# Altium schematic sheet AI.SchDoc
size 304 x 304 mm; SheetNumber: 3; SheetTotal: 15
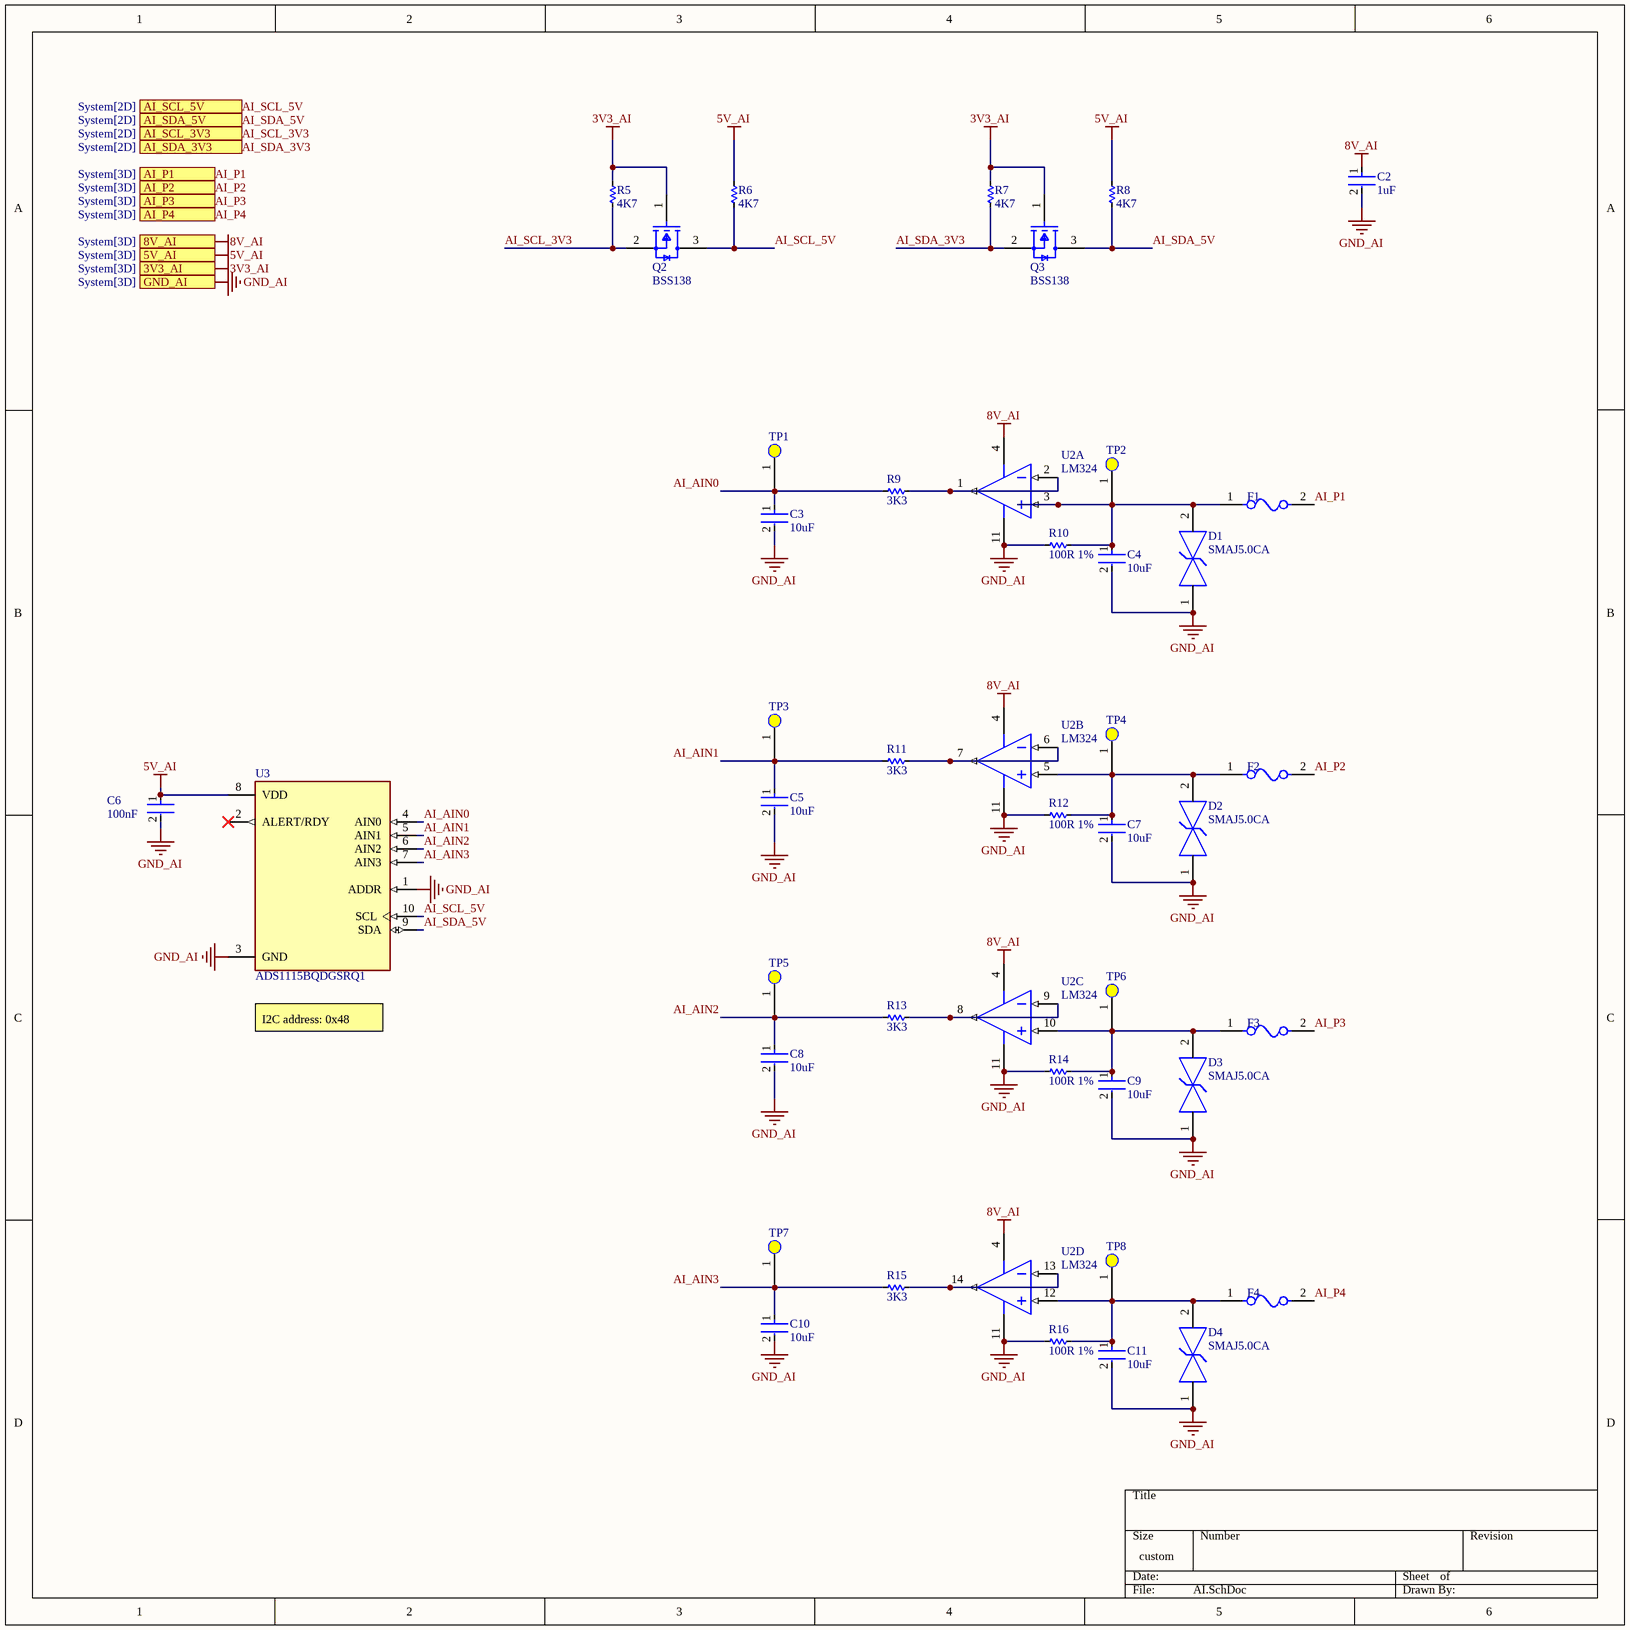
[diagram p0: AI.SchDoc]

## Parts
C2  1uF  [FP-GRM18-0_15-MFG]
C3  10uF  [FP-GRM18-0_15-MFG]
C4  10uF  [FP-GRM18-0_15-MFG]
C5  10uF  [FP-GRM18-0_15-MFG]
C6  100nF  [FP-GRM18-0_15-MFG]
C7  10uF  [FP-GRM18-0_15-MFG]
C8  10uF  [FP-GRM18-0_15-MFG]
C9  10uF  [FP-GRM18-0_15-MFG]
C10  10uF  [FP-GRM18-0_15-MFG]
C11  10uF  [FP-GRM18-0_15-MFG]
D1  SMAJ5.0CA  [FP-SMAJ-MFG]
D2  SMAJ5.0CA  [FP-SMAJ-MFG]
D3  SMAJ5.0CA  [FP-SMAJ-MFG]
D4  SMAJ5.0CA  [FP-SMAJ-MFG]
F1  CLA1683  [FP-0468-MFG]  (value not drawn)
F2  CLA1683  [FP-0468-MFG]  (value not drawn)
F3  CLA1683  [FP-0468-MFG]  (value not drawn)
F4  CLA1683  [FP-0468-MFG]  (value not drawn)
Q2  BSS138  [FP-318-08-IPC_B]
Q3  BSS138  [FP-318-08-IPC_B]
R5  4K7  [RES-SMD-0603]
R6  4K7  [RES-SMD-0603]
R7  4K7  [RES-SMD-0603]
R8  4K7  [RES-SMD-0603]
R9  3K3  [RES-SMD-0603]
R10  100R 1%  [RES-SMD-0805]
R11  3K3  [RES-SMD-0603]
R12  100R 1%  [RES-SMD-0805]
R13  3K3  [RES-SMD-0603]
R14  100R 1%  [RES-SMD-0805]
R15  3K3  [RES-SMD-0603]
R16  100R 1%  [RES-SMD-0805]
TP1  Test Point  [Test Point]  (value not drawn)
TP2  Test Point  [Test Point]  (value not drawn)
TP3  Test Point  [Test Point]  (value not drawn)
TP4  Test Point  [Test Point]  (value not drawn)
TP5  Test Point  [Test Point]  (value not drawn)
TP6  Test Point  [Test Point]  (value not drawn)
TP7  Test Point  [Test Point]  (value not drawn)
TP8  Test Point  [Test Point]  (value not drawn)
U2  LM324  [D0014A_N]  (parts A,B,C,D of 4)
U3  ADS1115BQDGSRQ1  [SOP50P490X110-10N]

## Ports
3V3_AI (see System[3D]), 5V_AI (see System[3D]), 8V_AI (see System[3D]), AI_P1 (see System[3D]), AI_P2 (see System[3D]), AI_P3 (see System[3D]), AI_P4 (see System[3D]), AI_SCL_3V3 (see System[2D]), AI_SCL_5V (see System[2D]), AI_SDA_3V3 (see System[2D]), AI_SDA_5V (see System[2D]), GND_AI (see System[3D])

## Nets
3V3_AI: Q2.1(G) Q3.1(G) R5.1 R7.1 ; port 3V3_AI
5V_AI: C6.1 R6.1 R8.1 U3.8(VDD) ; port 5V_AI
8V_AI: C2.1 U2.4(VCC+) ; port 8V_AI
GND_AI: C2.2 C3.2 C4.2 C5.2 C6.2 C7.2 C8.2 C9.2 C10.2 C11.2 D1.1 D2.1 D3.1 D4.1 R10.2 R12.2 R14.2 R16.2 U2.11(VCC-) U3.1(ADDR) U3.3(GND) ; port GND_AI
AI_AIN0: C3.1 R9.2 TP1.1(Test_Point) U3.4(AIN0)
AI_AIN1: C5.1 R11.2 TP3.1(Test_Point) U3.5(AIN1)
AI_AIN2: C8.1 R13.2 TP5.1(Test_Point) U3.6(AIN2)
AI_AIN3: C10.1 R15.2 TP7.1(Test_Point) U3.7(AIN3)
AI_P1: F1.2 ; port AI_P1
AI_P2: F2.2 ; port AI_P2
AI_P3: F3.2 ; port AI_P3
AI_P4: F4.2 ; port AI_P4
AI_SCL_3V3: Q2.2(S) R5.2 ; port AI_SCL_3V3
AI_SCL_5V: Q2.3(D) R6.2 U3.10(SCL) ; port AI_SCL_5V
AI_SDA_3V3: Q3.2(S) R7.2 ; port AI_SDA_3V3
AI_SDA_5V: Q3.3(D) R8.2 U3.9(SDA) ; port AI_SDA_5V
NetC4_1: C4.1 D1.2 F1.1 R10.1 TP2.1(Test_Point) U2.3(IN1+)
NetC7_1: C7.1 D2.2 F2.1 R12.1 TP4.1(Test_Point) U2.5(IN2+)
NetC9_1: C9.1 D3.2 F3.1 R14.1 TP6.1(Test_Point) U2.10(IN3+)
NetC11_1: C11.1 D4.2 F4.1 R16.1 TP8.1(Test_Point) U2.12(IN4+)
NetR9_1: R9.1 U2.1(OUT1) U2.2(IN1-)
NetR11_1: R11.1 U2.6(IN2-) U2.7(OUT2)
NetR13_1: R13.1 U2.8(OUT3) U2.9(IN3-)
NetR15_1: R15.1 U2.13(IN4-) U2.14(OUT4)

Not connected (* = marked no-connect by the designer): U3 2(ALERT/RDY)*

## Notes on the sheet
- (near U3) I2C address: 0x48

## Library data of the parts
C2 = CMP-2000-05448-2: CAP CER 1UF 10V X5R 0603; Manufacturer Part Number: GRM188R61A106KE69D; Manufacturer: Murata; Temperature Coefficient: 15%; Value: 10uF; Material: Ceramic; Tolerance: 10%; Device Class L1: Passive Components; ComponentLink2Description: Datasheet; Height: 0.95mm; Package: GRM18-0.15; Octopart: https://octopart.com/grm188r61a106ke69d-murata-22851381; Digikey Description: CAP CER 10UF 10V X5R 0603; Temperature Range High: +85°C; Temperature Range Low: -55°C; Temperature Characteristic: X5R; Capacitance: 10uF; RoHS: TRUE; Device Class L2: Capacitors; ComponentLink2URL: https://search.murata.co.jp/Ceramy/image/img/A01X/G101/ENG/GRM188R61A106KE69-01A.pdf; Device Class L3: Ceramic Capacitors; Lead Free: Yes; Mouser Description: Multilayer Ceramic Capacitors MLCC - SMD/SMT 0603 10uF 10volts X5R + - 10%; Category: Cap; Voltage Rating: 10V; Temperature: -55°C to +85°C; Automotive: No
C3-C5 C7-C11 = CMP-2000-05448-2: CAP CER 10UF 10V X5R 0603; Manufacturer Part Number: GRM188R61A106KE69D; Manufacturer: Murata; Temperature Coefficient: 15%; Material: Ceramic; Tolerance: 10%; Device Class L1: Passive Components; ComponentLink2Description: Datasheet; Height: 0.95mm; Package: GRM18-0.15; Octopart: https://octopart.com/grm188r61a106ke69d-murata-22851381; Value: 10uF; Digikey Description: CAP CER 10UF 10V X5R 0603; Temperature Range High: +85°C; Temperature Range Low: -55°C; Temperature Characteristic: X5R; Capacitance: 10uF; RoHS: TRUE; Device Class L2: Capacitors; ComponentLink2URL: https://search.murata.co.jp/Ceramy/image/img/A01X/G101/ENG/GRM188R61A106KE69-01A.pdf; Device Class L3: Ceramic Capacitors; Lead Free: Yes; Mouser Description: Multilayer Ceramic Capacitors MLCC - SMD/SMT 0603 10uF 10volts X5R + - 10%; Category: Cap; Voltage Rating: 10V; Temperature: -55°C to +85°C; Automotive: No
C6 = CMP-2000-05448-2: CAP CER 10V X5R 0603; Manufacturer Part Number: GRM188R61A106KE69D; Manufacturer: Murata; Temperature Coefficient: 15%; Value: 10uF; Material: Ceramic; Tolerance: 10%; Device Class L1: Passive Components; ComponentLink2Description: Datasheet; Height: 0.95mm; Package: GRM18-0.15; Octopart: https://octopart.com/grm188r61a106ke69d-murata-22851381; Digikey Description: CAP CER 10UF 10V X5R 0603; Temperature Range High: +85°C; Temperature Range Low: -55°C; Temperature Characteristic: X5R; Capacitance: 10uF; RoHS: TRUE; Device Class L2: Capacitors; ComponentLink2URL: https://search.murata.co.jp/Ceramy/image/img/A01X/G101/ENG/GRM188R61A106KE69-01A.pdf; Device Class L3: Ceramic Capacitors; Lead Free: Yes; Mouser Description: Multilayer Ceramic Capacitors MLCC - SMD/SMT 0603 10uF 10volts X5R + - 10%; Category: Cap; Voltage Rating: 10V; Temperature: -55°C to +85°C; Automotive: No
D1-D4 = CMP-08607-000067-1: SMAJ5.0CA TVS Diode 5V 400W SMA(DO-214AC); Manufacturer: Littelfuse Inc; Manufacturer Part Number: SMAJ58CA; Reverse Standoff Voltage: 58V; Breakdown Voltage: 64.4V; Peak Pulse Current: 4.3A; Direction: Bidirectional; Clamping Voltage: 93.6V; Number Of Channels: 1; Max Junction Temp: +150°C; Device Class L2: TVS Diodes; ComponentLink2Description: Datasheet; Lead Free: Yes; Height: 2.29mm; Automotive: No; Package: SMAJ; Digikey Description: TVS DIODE 58V 93.6V DO214AC; Temperature Range Low: -65°C; Device Class L1: Circuit Protection; Temperature Range High: +150°C; Mouser Description: In a Pack of 25, Littelfuse SMAJ58CA, Bi-Directional TVS Diode, 400W, 2-Pin DO-214AC; Octopart: https://octopart.com/smaj58ca-littelfuse-350202; ComponentLink2URL: https://www.littelfuse.com/~/media/electronics/datasheets/tvs_diodes/littelfuse_tvs_diode_smaj_datasheet.pdf.pdf; Temperature: -65°C to +150°C; Peak Pulse Power: 400W; Device Class L3: unset; Category: Diode; RoHS: TRUE; ComponentLink3Description: New link; ComponentLink3URL: https://linhkien.cxtvn.com/2607-smaj50ca-tvs-diode-5v-400w-smado-214ac.html
F1-F4 = CMP-08605-000076-1: 1206 0.05A 60V JZ PTC SMD; Manufacturer Part Number: 0468.500NR; Manufacturer: Littelfuse; Fuse Voltage Drop: 156.77mV; Fuse I2T: 0.031A2Sec; Fuse Interrupt Dc Current: 50A; Fuse Current: 0.5A; Resistance: 0.27Ω; Max Fuse Dc Voltage: 63V; Fuse Blow Speed: Slow; Value: 0.27Ω; Package: 0468; Digikey Description: FUSE BOARD MOUNT 500MA 63VAC/VDC; Mouser Description: Surface Mount Fuses 63V .5A Slo-Blo; Temperature Range High: +90°C; Lead Free: Yes; Height: 0.762mm; Device Class L1: Circuit Protection; Category: Fuse; Octopart: https://octopart.com/0468.500nr-littelfuse-672821; Fuse Interrupt Ac Current: 50A; Temperature Range Low: -55°C; Automotive: No; ComponentLink2URL: https://www.littelfuse.com/~/media/electronics/datasheets/fuses/littelfuse_fuse_468_datasheet.pdf.pdf; ComponentLink2Description: Datasheet; RoHS: TRUE; Max Fuse Ac Voltage: 63V; Temperature: -55°C to +90°C; Device Class L2: Fuses; Device Class L3: unset; Voltage Rating: 63V
Q2 Q3 = CMP-07173-000101-1: MOSFET N-CH 50V 220MA SOT-23; Turn-Off Delay Time: 20ns; Element Configuration: Single; Rds On Max: 3.5R; Gate to Source Voltage (Vgs): 20V; Threshold Voltage: 1.3V; Number of Elements: 1; Power Dissipation: 360mW; Rise Time: 9ns; Turn-On Delay Time: 2.5ns; Input Capacitance: 27pF; On-State Resistance: 6R; Lead Free: Lead Free; Length: 2.92mm; Width: 1.3mm; Drain to Source Breakdown Voltage: 50V; Min Operating Temperature: -55°C; REACH SVHC: No SVHC; Packaging: Tape and Reel; Radiation Hardening: No; Height: 0.93mm; Drain to Source Voltage (Vdss): 50V; Current Rating: 220mA; Voltage Rating (DC): 50V; Weight: 0.03g; Continuous Drain Current (ID): 220mA; Number of Pins: 3; Nominal Vgs: 1.3V; Max Power Dissipation: 360mW; Fall Time: 9ns; Drain to Source Resistance: 3.5R; Contact Plating: Tin; Case/Package: SOT-23; Package Quantity: 1; Dual Supply Voltage: 50V; Mount: Surface Mount; Termination: SMD/SMT; Max Operating Temperature: 150°C
R5-R9 R11 R13 R15 = Res-SMD: Res 0603 5%; Manufacturer: Generic Components; Class: Passive; Published: 08/06/2000; Publisher: Altium Hobart Technology Centre
R10 R12 R14 R16 = Res-SMD: Res 0805 1%; Manufacturer: Generic Components; Class: Passive; Published: 08/06/2000; Publisher: Altium Hobart Technology Centre
U2 = CMP-0017-00129-2: JFET-Input Operational Amplifier, 7 to 36 V, 0 to 70 degC, 14-pin SOIC (D14), Green (RoHS & no Sb/Br); PartNumber: TL084CDR; Manufacturer: Texas Instruments; Sub Family: General Purpose Amplifier, High Supply Voltage Amplifier (>=30V); CMRR(Min)(dB): 70; Vio (25C)(Max)(mV): 15; Number of Channels: 4; Slew Rate(Typ)(V/us): 13; Iq per channel(Max)(mA): 2.8; Rating: Catalog; IIB(Max)(pA): 400; Total Supply Voltage(Min)(+5V is 5, +/-5V is 10): 7; Vn at 1kHz(Typ)(nV/rtHz): 18; Total Supply Voltage(Max)(+5V is 5, +/-5V is 10): 36; GBW(Typ)(MHz): 3; ComponentLink2Description: Datasheet; Eco-Plan: Green (RoHS & no Sb/Br); ComponentLink1Description: Manufacturer URL; PackageVersion: 4040047-5/M, 06/2011; ComponentLink2URL: http://www.ti.com/lit/ds/symlink/tl084.pdf; Mounting Technology: Surface Mount; ComponentLink3Description: Package Specification; ComponentLink3URL: http://www.ti.com/lit/ml/mpds177g/mpds177g.pdf; DatasheetVersion: SLOS081G; PackageDescription: 14-Pin Plastic Small Outline, Body 8.65 x 3.90 mm, Pitch 1.27 mm; PackageReference: D0014A; Offset Drift(Typ)(uV/C): 18; Code_JEDEC: MS-012; ComponentLink1URL: http://www.ti.com/
U3 = ADS1115BQDGSRQ1: Automotive 16-bit, 860-SPS, 4-ch, delta-sigma ADC with PGA, oscillator, VREF, comparator and I2C; MF: Texas Instruments; SnapEDA_Link: https://www.snapeda.com/parts/ADS1115BQDGSRQ1/Texas+Instruments/view-part/?ref=snap; Package: VSSOP-10 Texas Instruments; Value: *; MP: ADS1115BQDGSRQ1; Check_prices: https://www.snapeda.com/parts/ADS1115BQDGSRQ1/Texas+Instruments/view-part/?ref=eda